# EAGLE design MODUL_BRIDGE_V100 (EAGLE 6.4)
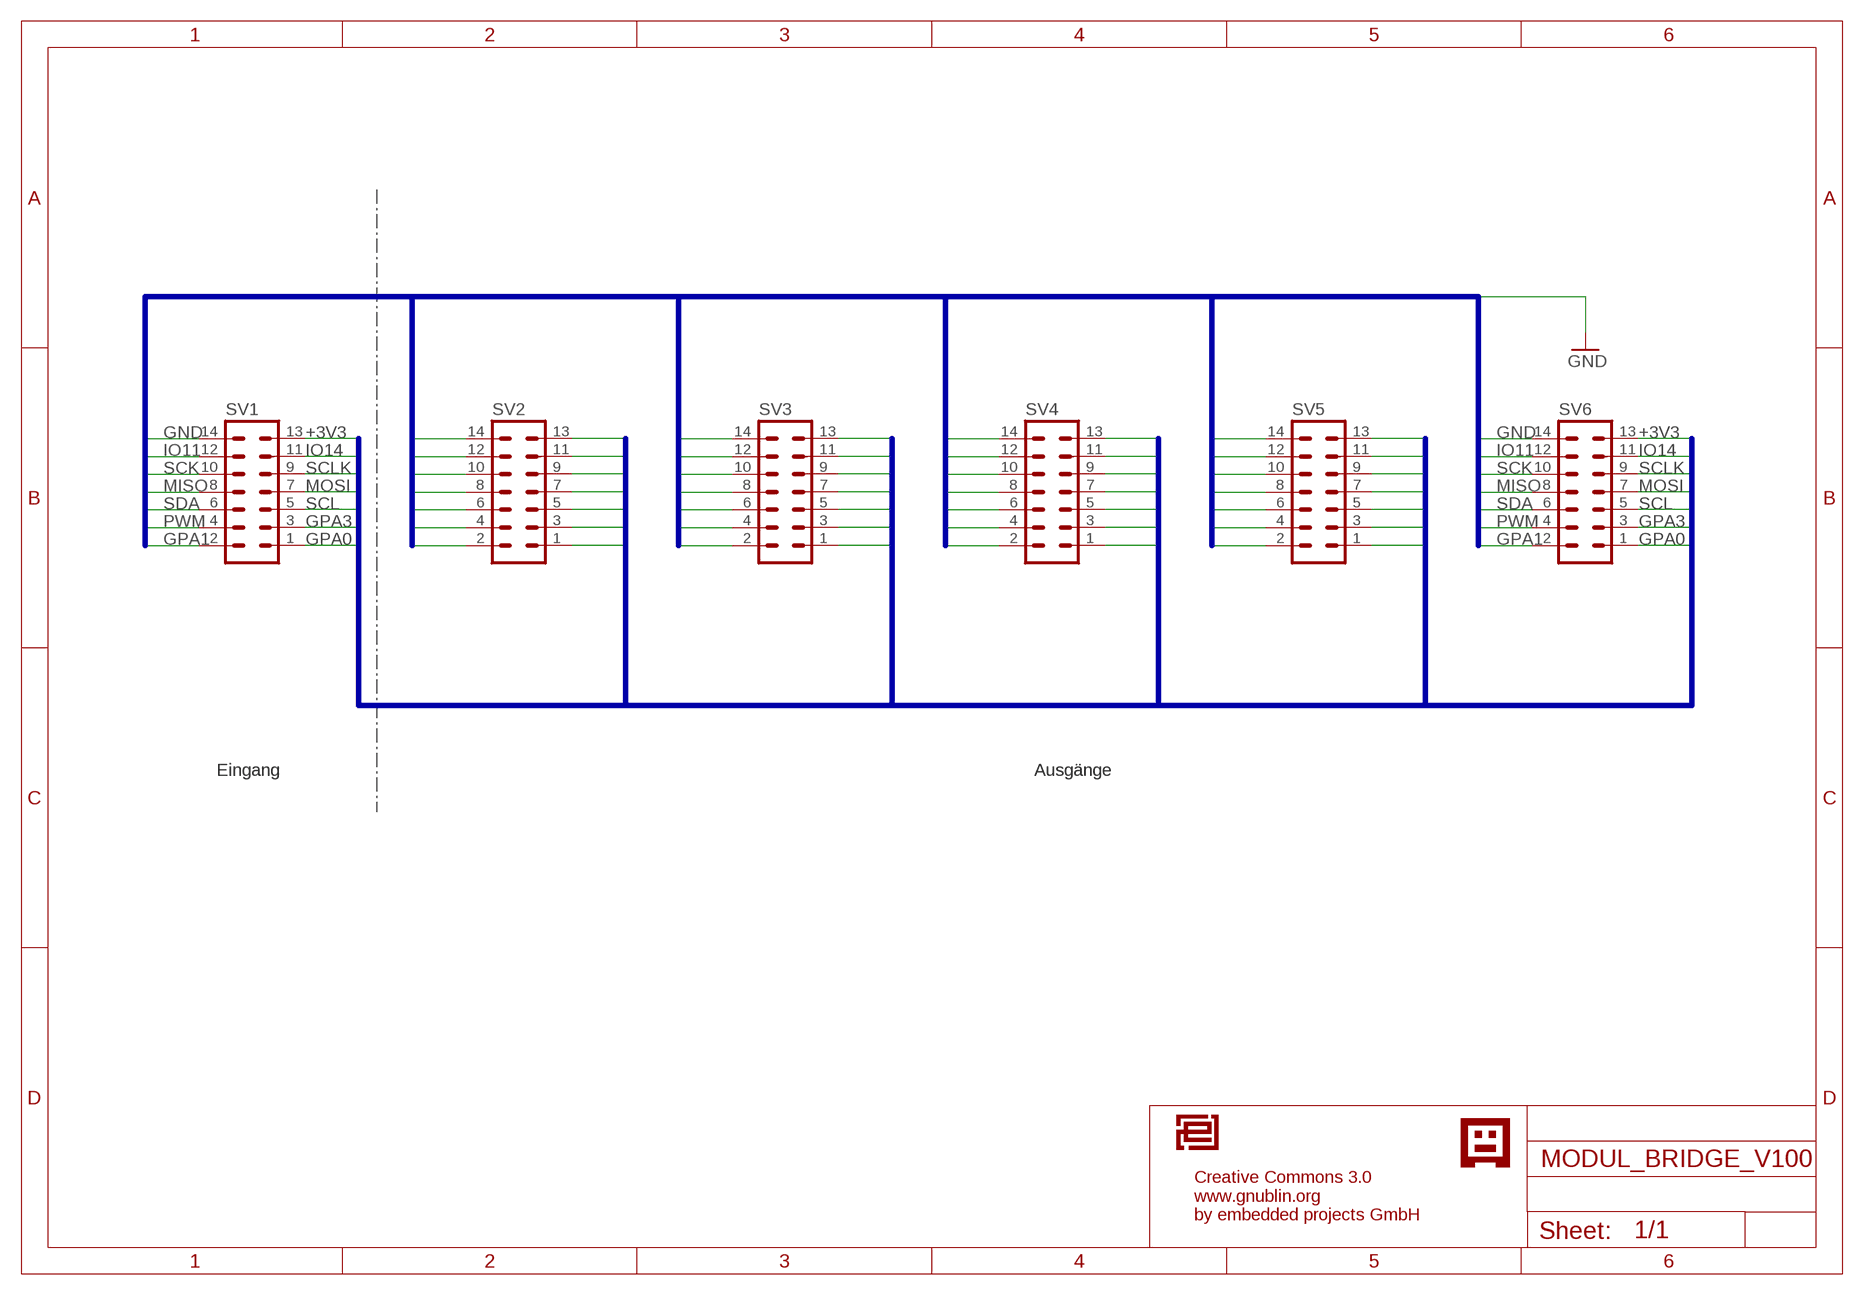
[diagram p0: schematic, sheet 1]

## Parts
SV1  ML14  [ML14]
SV2  ML14  [ML14]
SV3  ML14  [ML14]
SV4  ML14  [ML14]
SV5  ML14  [ML14]
SV6  ML14  [ML14]
U$1  EPLOGOSIEB  [EPLOGOSIEBDRUCK]
U$2  GNUBLINLOGOSIEB  [GNUSIEBDRUCK]

## Nets
+3V3: SV1.13 SV2.13 SV3.13 SV4.13 SV5.13 SV6.13
GND: SV1.14 SV2.14 SV3.14 SV4.14 SV5.14 SV6.14
GPA0: SV1.1 SV2.1 SV3.1 SV4.1 SV5.1 SV6.1
GPA1: SV1.2 SV2.2 SV3.2 SV4.2 SV5.2 SV6.2
GPA3: SV1.3 SV2.3 SV3.3 SV4.3 SV5.3 SV6.3
IO11: SV1.12 SV2.12 SV3.12 SV4.12 SV5.12 SV6.12
IO14: SV1.11 SV2.11 SV3.11 SV4.11 SV5.11 SV6.11
MISO: SV1.8 SV2.8 SV3.8 SV4.8 SV5.8 SV6.8
MOSI: SV1.7 SV2.7 SV3.7 SV4.7 SV5.7 SV6.7
PWM: SV1.4 SV2.4 SV3.4 SV4.4 SV5.4 SV6.4
SCK: SV1.10 SV2.10 SV3.10 SV4.10 SV5.10 SV6.10
SCL: SV1.5 SV2.5 SV3.5 SV4.5 SV5.5 SV6.5
SCLK: SV1.9 SV2.9 SV3.9 SV4.9 SV5.9 SV6.9
SDA: SV1.6 SV2.6 SV3.6 SV4.6 SV5.6 SV6.6

## Buses
B$1:GPA1,PWM,SDA,MISO,SCK,IO11,GND
B$2:GPA0,GPA3,SCL,MOSI,SCLK,IO14,+3V3

## Notes on the sheet
- Eingang | Ausgänge
- Creative Commons 3.0
  www.gnublin.org
  by embedded projects GmbH

## Library data of the parts
SV1-SV6 = con-ml:ML14: HARTING
U$1 = EmbeddedProjectsLogos2:EPLOGO
U$2 = EmbeddedProjectsLogos2:GNUBLINLOGO

## Board
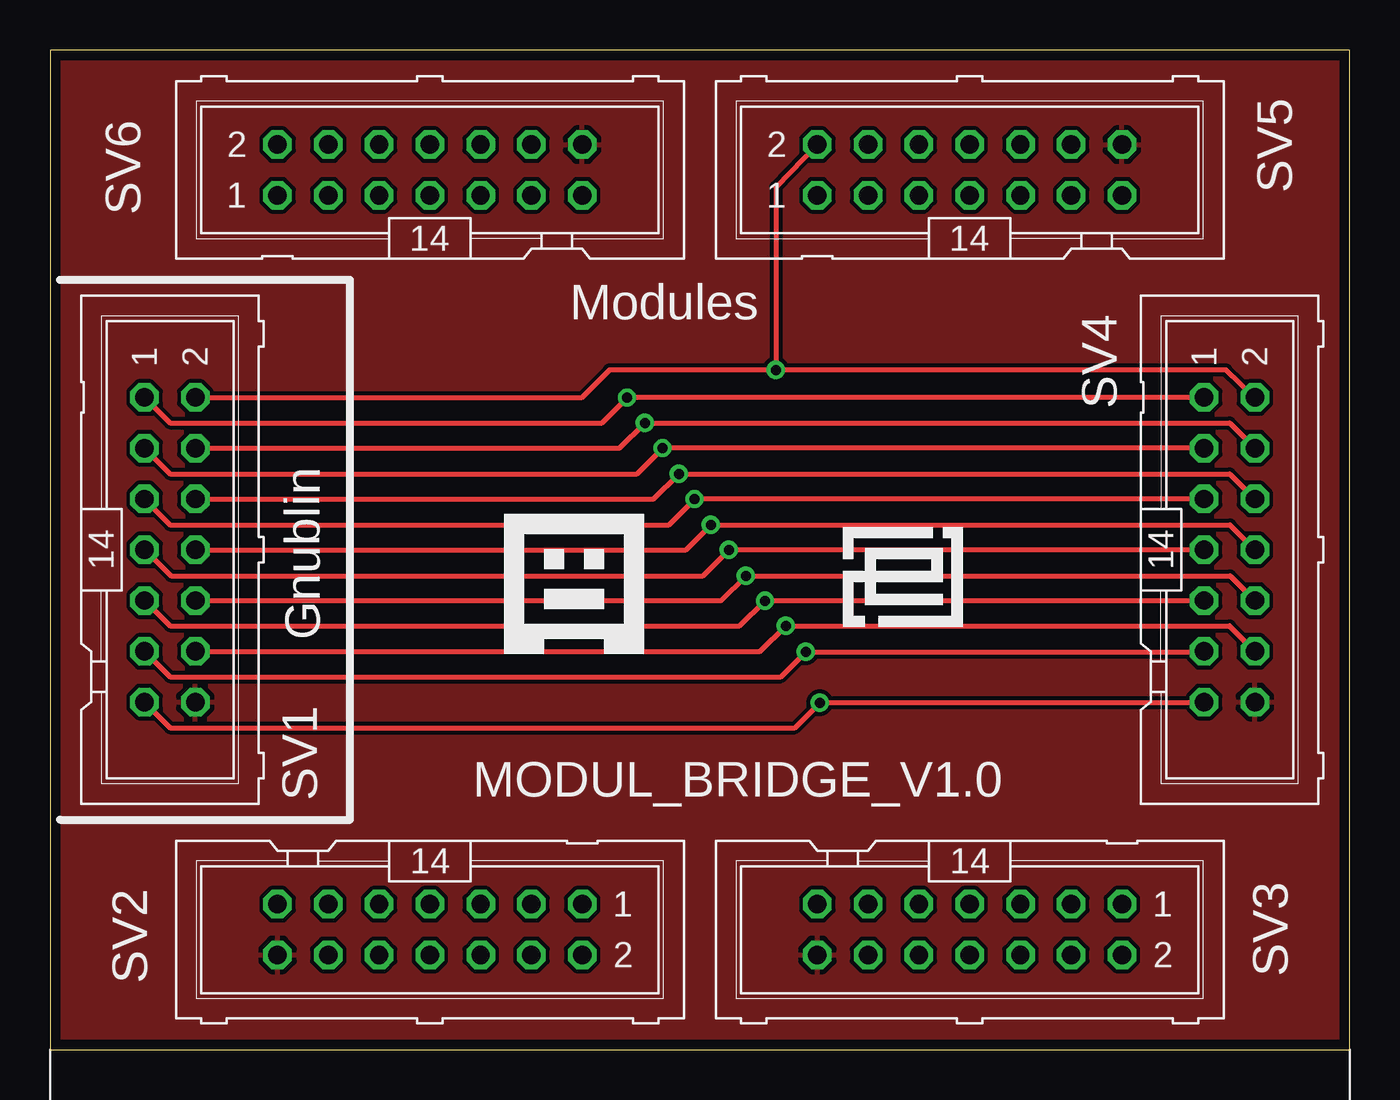
[diagram p1: board, top side]
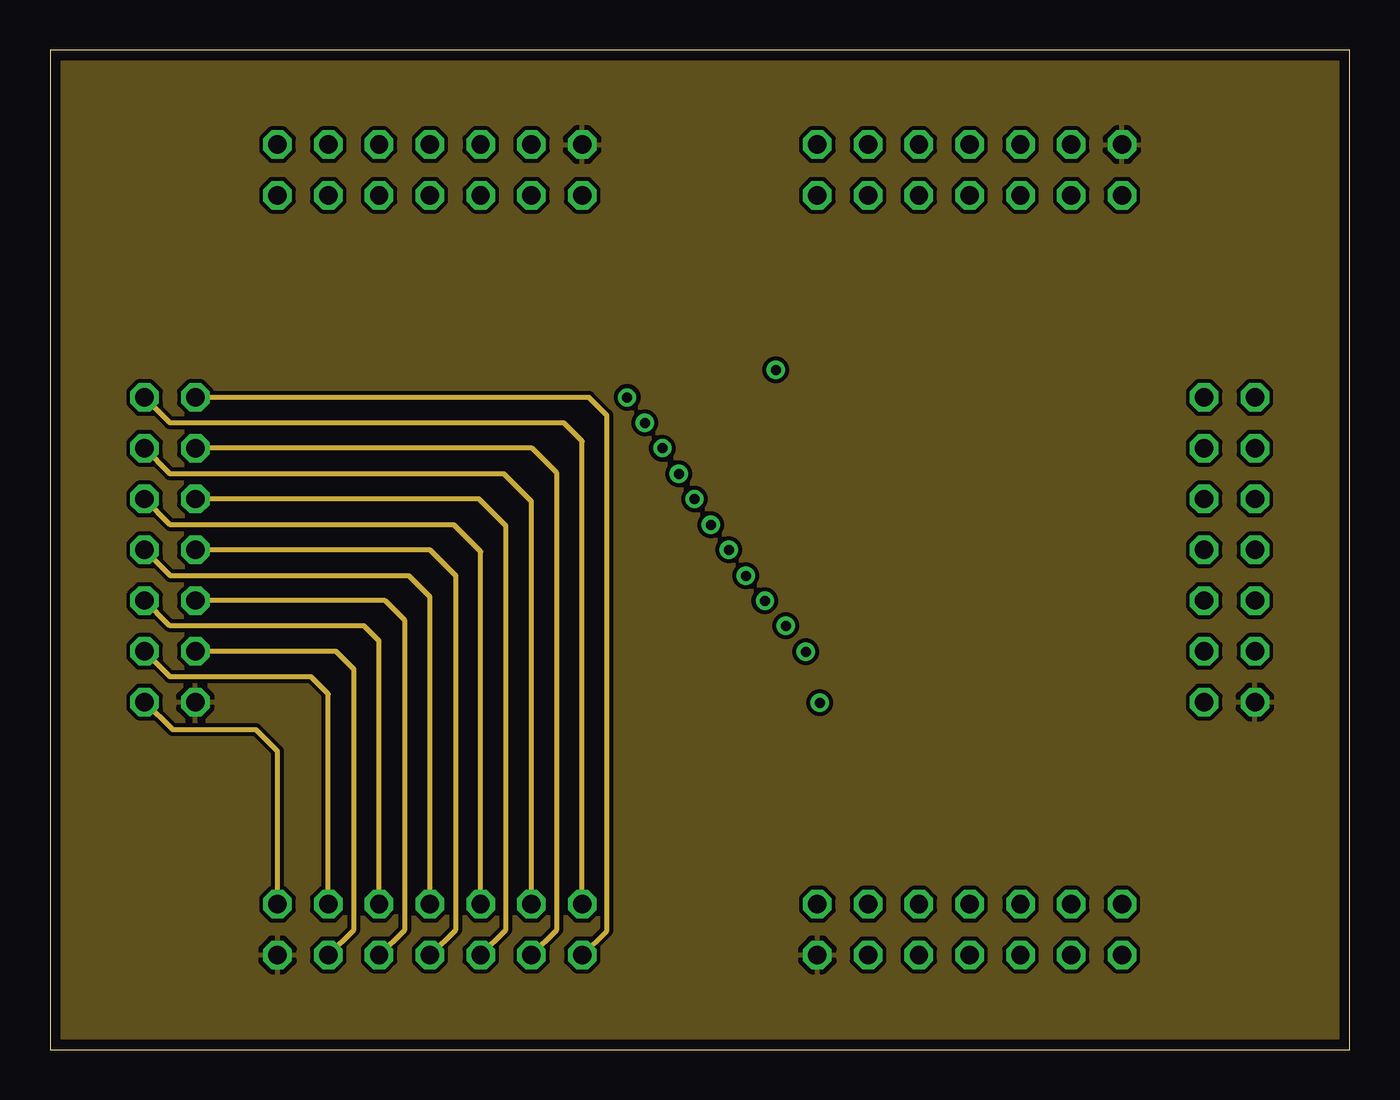
[diagram p2: board, inner layer Route2]
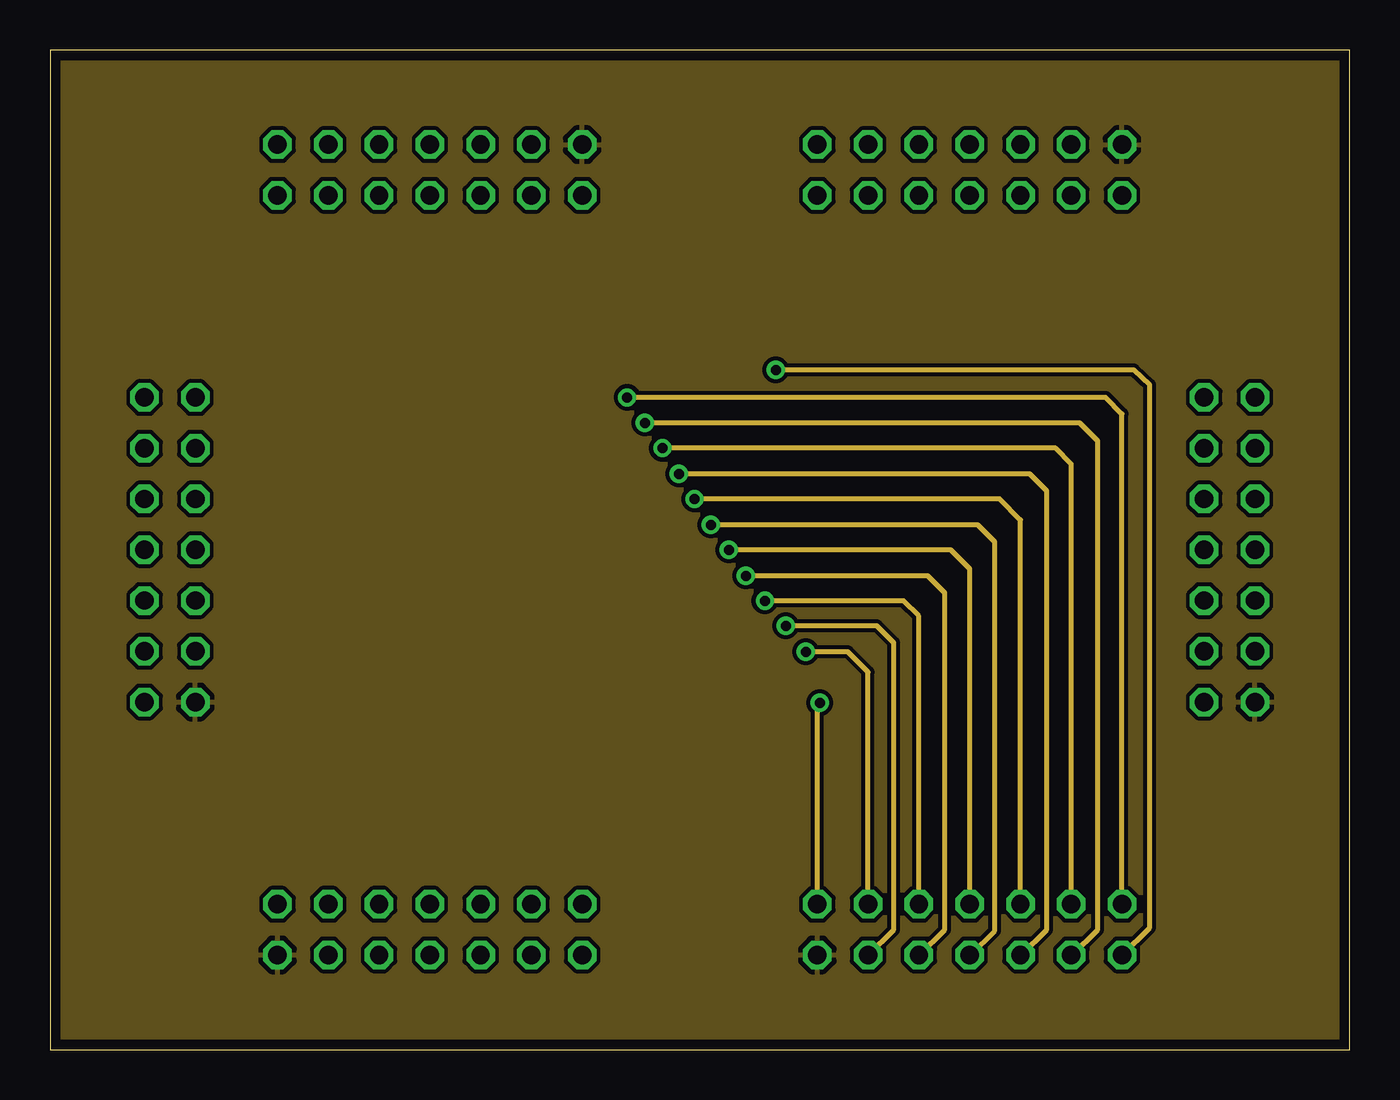
[diagram p3: board, inner layer Route3]
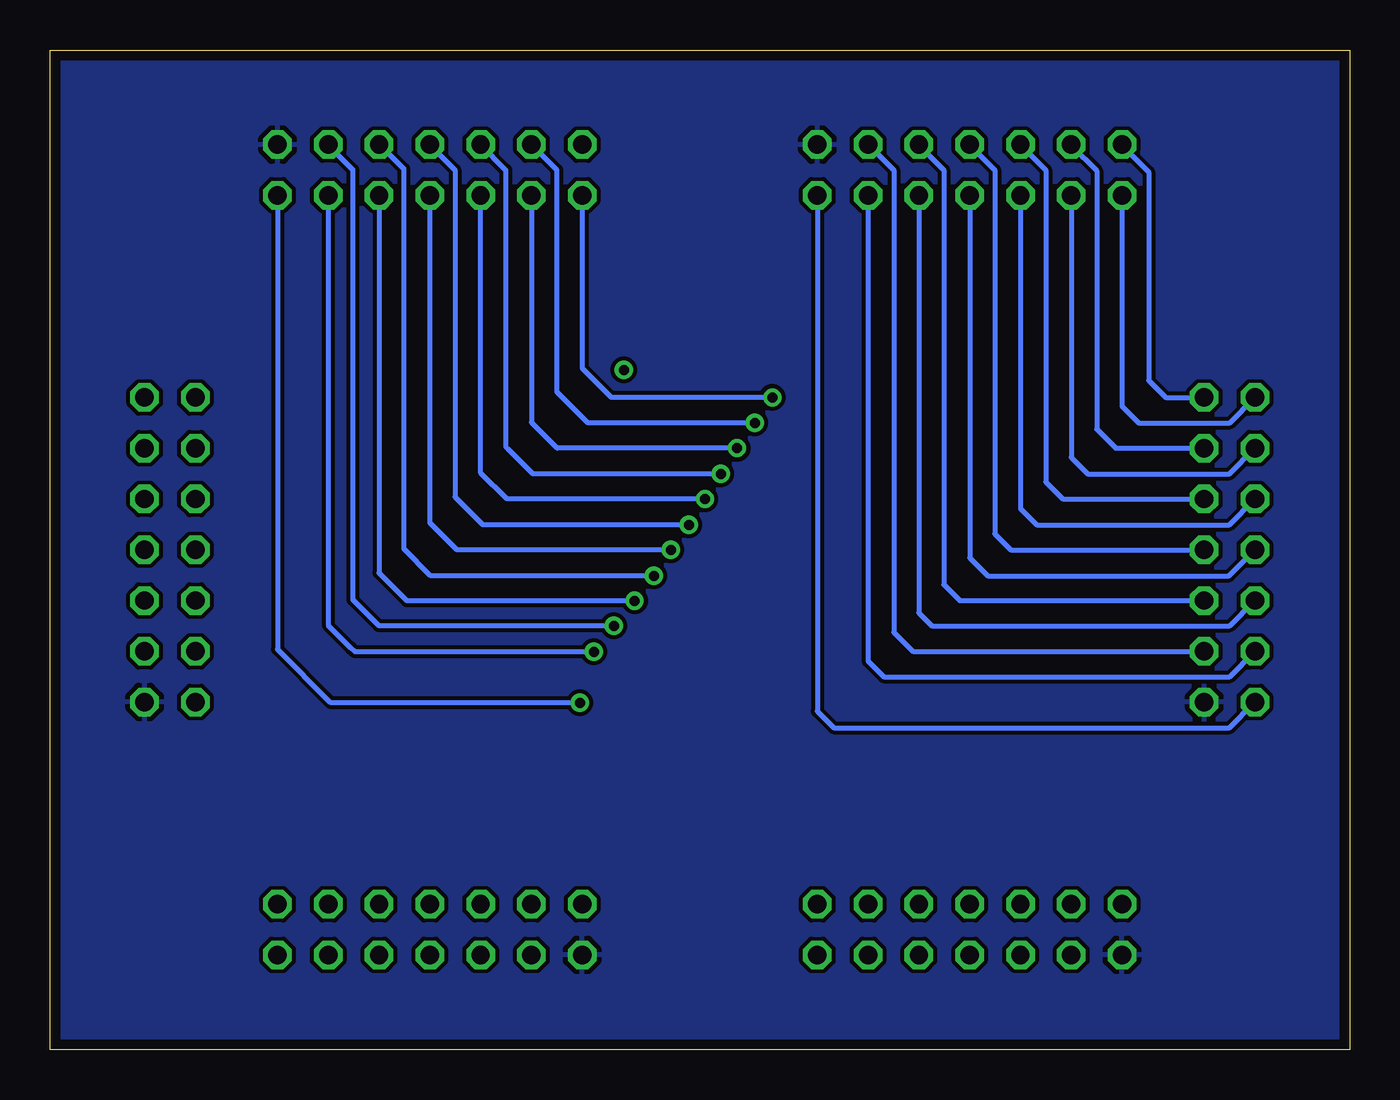
[diagram p4: board, bottom side, seen from below]

Size 65 x 50 mm. Coordinates in mm from the lower left corner, seen from the top.
Outline: 0,0 65,0 65,50 0,50 0,0
Copper layers (1*2+3*16): Top 0.035mm / dielectric 1.5mm / Route2 0.035mm / dielectric 0.15mm / Route3 0.035mm / dielectric 0.2mm / Bottom 0.035mm
Design rules "default *": minimum track width 10mil, minimum drill 24mil, track to track 8mil, track to pad 8mil, pad to pad 8mil, via to via 8mil, smd to smd 8mil, copper to edge 20mil, drill to drill 8mil, minimum pad ring 10mil, minimum via ring 8mil, stop-mask expansion 4mil, vias tented up to drill 40mil, thermal gap 10mil

### Footprints (pad centres in the part's own frame; a part is rotated, then mirrored left to right if it is on the bottom)
ML14 = drill 0.914 octagon: 1 -7.62,-1.27; 2 -7.62,1.27; 3 -5.08,-1.27; 4 -5.08,1.27; 5 -2.54,-1.27; 6 -2.54,1.27; 7 0,-1.27; 8 0,1.27; 9 2.54,-1.27; 10 2.54,1.27; 11 5.08,-1.27; 12 5.08,1.27; 13 7.62,-1.27; 14 7.62,1.27

### Placement (x,y rotation side)
SV1  6,25 270 top
SV2  19,6 180 top
SV3  46,6 180 top
SV4  59,25 270 top
SV5  46,44 0 top
SV6  19,44 0 top
U$1  39.65,21.15 0 top
U$2  22.7,19.8 0 top

### Tracks (layer width: path | path; a pad name or v marks a point on that pad's centre or on a via)
+3V3  (via drill 0.5)
  Top 0.254: SV1.13 6,16.1 37.25,16.1 v38.5,17.35 57.7,17.35 SV4.13
  Route2 0.254: SV2.13 11.38,14.92 10.3,16 6.16,16 SV1.13
  Route3 0.254: SV3.13 38.38,17.23 v38.5,17.35
  Bottom 0.254: SV6.13 26.62,16.92 25.8,16.1 6.01,16.1 SV1.13 | SV5.13 53.62,20.02 50.95,17.35 50.7,17.35 v38.5,17.35
GND
  pour Top: -1.35,51.45 67,51.45 67,-1.8 -1.35,-1.8
  pour Bottom: -1.05,51.2 66.65,51.2 66.65,-1.5 -1.05,-1.5
  pour Route2: -0.85,51 66.25,51 66.25,-1.2 -0.85,-1.2
  pour Route3: -0.4,50.65 66.2,50.65 66.2,-1.2 -0.4,-1.2
GPA0  (via drill 0.5)
  Top 0.254: SV1.1 6,31.35 27.6,31.35 28.85,32.6 v28.87,32.62 SV4.1
  Route2 0.254: SV2.1 26.62,30.43 25.7,31.35 6,31.35 SV1.1
  Route3 0.254: SV3.1 53.62,31.8 52.8,32.62 v28.87,32.62
  Bottom 0.254: SV6.1 11.38,32.18 10.55,31.35 6,31.35 SV1.1 | v28.87,32.62 36.92,32.62 38.35,34.05 38.38,34.08 SV5.1
GPA1  (via drill 0.5)
  Top 0.254: SV1.2 26.61,32.62 27.98,33.99 35.7,33.99 36.35,33.99 | SV4.2 60.22,32.64 58.82,33.99 36.35,33.99 | SV5.2 36.3,43.15 v36.3,34 36.3,34.04 36.35,33.99
  Route2 0.254: SV2.2 27.85,5.95 27.85,31.72 26.95,32.62 SV1.2
  Route3 0.254: SV3.2 55,6.1 55,33.24 54.2,33.99 v36.31,33.99 v36.3,34
  Bottom 0.254: SV6.2 11.38,45.23 10.05,43.9 10.05,33.47 9.2,32.62 SV1.2
GPA3  (via drill 0.5)
  Top 0.254: SV1.3 6,28.8 29.35,28.8 30.6,30.05 v30.63,30.08 SV4.3
  Route2 0.254: SV2.3 24.08,27.42 22.7,28.8 6.01,28.8 SV1.3
  Route3 0.254: SV3.3 51.08,29.3 50.3,30.08 v30.63,30.08
  Bottom 0.254: SV6.3 13.92,29.62 13.1,28.8 6.01,28.8 SV1.3 | v30.63,30.08 39.63,30.08 40.9,31.35 40.92,31.37 SV5.3
IO11  (via drill 0.5)
  Top 0.254: SV1.12 35.52,19.92 v36.8,21.2 58.99,21.2 SV4.12
  Route2 0.254: SV2.12 15.2,6 15.2,19.02 14.3,19.92 SV1.12
  Route3 0.254: SV3.12 42.2,6 42.2,20.35 41.35,21.2 v36.8,21.2
  Bottom 0.254: SV6.12 22.8,44 22.8,20.87 21.85,19.92 SV1.12 | SV5.12 51.08,45.23 49.85,44 49.85,22.5 48.55,21.2 v36.8,21.2
IO14  (via drill 0.5)
  Top 0.254: SV1.11 6,18.65 36.55,18.65 v37.8,19.9 57.71,19.9 SV4.11
  Route2 0.254: SV2.11 13.92,17.78 13.05,18.65 6,18.65 SV1.11
  Route3 0.254: SV3.11 40.92,18.88 39.9,19.9 v37.8,19.9
  Bottom 0.254: SV6.11 24.08,19.43 23.3,18.65 6,18.65 SV1.11 | SV5.11 51.08,21.22 49.95,20.09 49.75,19.9 v37.8,19.9
MISO  (via drill 0.5)
  Top 0.254: SV1.8 31.8,25 v33.05,26.25 59.02,26.25 SV4.8
  Route2 0.254: SV2.8 19.03,4.73 20.3,6 20.3,23.7 19,25 SV1.8
  Route3 0.254: SV3.8 46.03,4.73 47.25,5.95 47.25,25.4 46.4,26.25 v33.05,26.25
  Bottom 0.254: SV6.8 19,45.25 17.75,44 17.75,25.8 16.95,25 SV1.8 | v33.05,26.25 43.35,26.25 44.65,27.55 44.75,27.65 44.75,44 46,45.25 SV5.8
MOSI  (via drill 0.5)
  Top 0.254: SV1.7 4.75,25 6.05,23.7 32.65,23.7 v33.95,25 SV4.7
  Route2 0.254: SV2.7 19,22.65 17.95,23.7 6.03,23.7 SV1.7
  Route3 0.254: SV3.7 46,24.05 45.05,25 v33.95,25
  Bottom 0.254: SV6.7 19,24.6 18.1,23.7 6.03,23.7 SV1.7 | v33.95,25 44.65,25 46,26.35 SV5.7
PWM  (via drill 0.5)
  Top 0.254: SV1.4 28.48,30.08 v29.75,31.35 59,31.35 SV4.4
  Route2 0.254: SV2.4 25.35,6 25.35,28.83 24.1,30.08 SV1.4
  Route3 0.254: SV3.4 51.13,4.73 52.4,6 52.4,30.45 51.5,31.35 v29.75,31.35
  Bottom 0.254: SV6.4 13.92,45.22 12.65,43.95 12.65,31.03 11.7,30.08 SV1.4 | v29.75,31.35 38.1,31.35 39.65,32.9 39.65,44 SV5.4
SCK  (via drill 0.5)
  Top 0.254: SV1.10 33.56,22.46 v34.8,23.7 59.03,23.7 SV4.10
  Route2 0.254: SV2.10 16.48,4.73 17.75,6 17.75,21.46 16.75,22.46 SV1.10
  Route3 0.254: SV3.10 43.48,4.73 44.75,6 44.75,22.85 43.9,23.7 v34.8,23.7
  Bottom 0.254: SV6.10 21.54,45.24 20.3,44 20.3,23.26 19.5,22.46 SV1.10 | SV5.10 48.52,45.27 47.3,44.05 47.3,25.05 45.95,23.7 45.85,23.7 v34.8,23.7
SCL  (via drill 0.5)
  Top 0.254: SV1.5 4.73,27.52 6,26.25 30.95,26.25 32.2,27.5 v32.24,27.54 SV4.5
  Route2 0.254: SV2.5 21.54,24.91 20.2,26.25 6.02,26.25 SV1.5
  Route3 0.254: SV3.5 48.54,26.5 47.5,27.54 v32.24,27.54
  Bottom 0.254: SV6.5 16.46,27.06 15.65,26.25 6.02,26.25 SV1.5 | v32.24,27.54 42.14,27.54 43.45,28.85 SV5.5
SCLK  (via drill 0.5)
  Top 0.254: SV1.9 6,21.2 34.47,21.2 34.48,21.2 v35.75,22.45 SV4.9
  Route2 0.254: SV2.9 16.46,20.44 15.7,21.2 5.99,21.2 SV1.9
  Route3 0.254: SV3.9 43.46,21.68 42.7,22.44 35.76,22.44 v35.75,22.45
  Bottom 0.254: SV6.9 21.54,21.84 20.9,21.2 5.99,21.2 SV1.9 | SV5.9 48.54,23.84 47.14,22.44 46.7,22.45 v35.75,22.45
SDA  (via drill 0.5)
  Top 0.254: SV1.6 30.19,27.54 v31.45,28.8 59.01,28.8 SV4.6
  Route2 0.254: SV2.6 22.8,6 22.8,26.19 21.45,27.54 SV1.6
  Route3 0.254: SV3.6 48.58,4.73 49.85,6 49.85,27.95 49,28.8 v31.45,28.8
  Bottom 0.254: SV6.6 15.2,44 15.2,28.39 14.35,27.54 SV1.6 | v31.45,28.8 40.85,28.8 42.1,30.05 42.2,30.15 42.2,44 SV5.6

### Text on the board
tPlace: Modules | Gnublin | MODUL_BRIDGE_V1.0